# Altium schematic sheet 19_SOLENOID_OF.SchDoc
size 420 x 297 mm; SheetNumber: 33; SheetTotal: 36
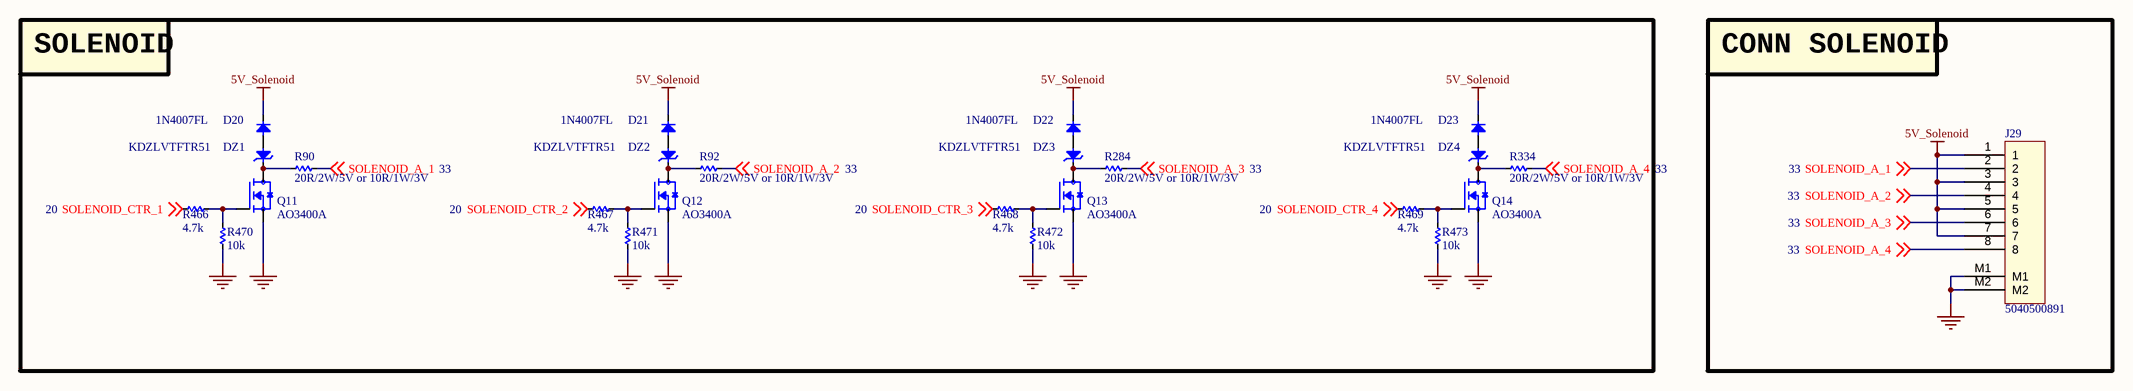
[diagram p0: 19_SOLENOID_OF.SchDoc]

## Parts
D20  1N4007FL  [SOD3717X145N]
D21  1N4007FL  [SOD3717X145N]
D22  1N4007FL  [SOD3717X145N]
D23  1N4007FL  [SOD3717X145N]
DZ1  KDZLVTFTR51  [SOD3717X145N]
DZ2  KDZLVTFTR51  [SOD3717X145N]
DZ3  KDZLVTFTR51  [SOD3717X145N]
DZ4  KDZLVTFTR51  [SOD3717X145N]
J29  5040500891  [MOLEX_5040500891]
Q11  AO3400A  [SOT95P240X120-3N]
Q12  AO3400A  [SOT95P240X120-3N]
Q13  AO3400A  [SOT95P240X120-3N]
Q14  AO3400A  [SOT95P240X120-3N]
R90  20R/2W/5V or 10R/1W/3V  [RES_C_6331X65_N]
R92  20R/2W/5V or 10R/1W/3V  [RES_C_6331X65_N]
R284  20R/2W/5V or 10R/1W/3V  [RES_C_6331X65_N]
R334  20R/2W/5V or 10R/1W/3V  [RES_C_6331X65_N]
R466  4.7k  [RES_C_1005X40]
R467  4.7k  [RES_C_1005X40]
R468  4.7k  [RES_C_1005X40]
R469  4.7k  [RES_C_1005X40]
R470  10k  [RES_C_1005X40]
R471  10k  [RES_C_1005X40]
R472  10k  [RES_C_1005X40]
R473  10k  [RES_C_1005X40]

## Blocks framed on the sheet
SOLENOID: D20-D23 DZ1-DZ4 Q11-Q14 R90 R92 R284 R334 R466-R473
CONN SOLENOID: J29

## Nets
5V_Solenoid: D20.1(K) D21.1(K) D22.1(K) D23.1(K) J29.1 J29.3 J29.5 J29.7
GND: J29.M1 J29.M2 Q11.2(S) Q12.2(S) Q13.2(S) Q14.2(S) R470.1 R471.1 R472.1 R473.1
SOLENOID_A_1: J29.2 R90.1 ; off-sheet SOLENOID_A_1
SOLENOID_A_2: J29.4 R92.1 ; off-sheet SOLENOID_A_2
SOLENOID_A_3: J29.6 R284.1 ; off-sheet SOLENOID_A_3
SOLENOID_A_4: J29.8 R334.1 ; off-sheet SOLENOID_A_4
SOLENOID_CTR_1: R466.2 ; off-sheet SOLENOID_CTR_1
SOLENOID_CTR_2: R467.2 ; off-sheet SOLENOID_CTR_2
SOLENOID_CTR_3: R468.2 ; off-sheet SOLENOID_CTR_3
SOLENOID_CTR_4: R469.2 ; off-sheet SOLENOID_CTR_4
NetD20_2: D20.2(A) DZ1.2(A)
NetD21_2: D21.2(A) DZ2.2(A)
NetD22_2: D22.2(A) DZ3.2(A)
NetD23_2: D23.2(A) DZ4.2(A)
NetDZ1_1: DZ1.1(K) Q11.3(D) R90.2
NetDZ2_1: DZ2.1(K) Q12.3(D) R92.2
NetDZ3_1: DZ3.1(K) Q13.3(D) R284.2
NetDZ4_1: DZ4.1(K) Q14.3(D) R334.2
NetQ11_1: Q11.1(G) R466.1 R470.2
NetQ12_1: Q12.1(G) R467.1 R471.2
NetQ13_1: Q13.1(G) R468.1 R472.2
NetQ14_1: Q14.1(G) R469.1 R473.2

## Notes on the sheet
- Project:
- Sub-system:
- Design by:
- Sheet title:
- Sheet
- of
- Checked by:
- Approved by:
- Revision:
- Document No:
- Size:
- Date:
- A3

## Library data of the parts
D20-D23 = Diode SMD: Default Diode; Code - JEDEC: DO-214-AB; Value: 1N5007; Published: 8-Jun-2000; Revision: July-2002: Re-released for DXP Platform.; Publisher: Altium Limited
DZ1-DZ4 = DIODE Zener: Zenner
J29 = Header 8x1_2M
Q11-Q14 = MOSFET_N: N-Channel 30 V 5.7A (Ta) 1.4W (Ta) Surface Mount SOT-23-3; MF: Alpha & Omega Semiconductor; SnapEDA_Link: https://www.snapeda.com/parts/AO3400A/Alpha/view-part/?ref=snap; Package: SOT-23 Alpha &amp; Omega Semiconductor Inc.; Value: *; MP: AO3400A; Check_prices: https://www.snapeda.com/parts/AO3400A/Alpha/view-part/?ref=eda
R90 R92 R284 R334 R466-R473 = _RES_B_2: RES